# EAGLE schematic soic-8_breakout (EAGLE 7.7.0)
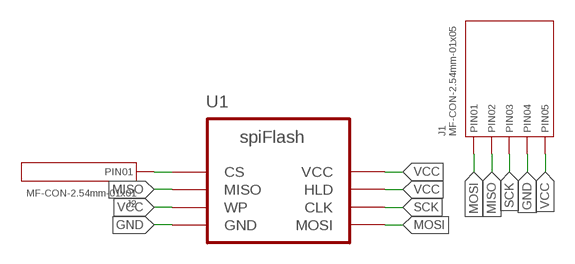
[diagram p0: schematic, sheet 1]

## Parts
J1  MF-CON-2.54mm-01x05  CON_01X05_PTH_2.54MM  [PTH_2.54MM_01X05]
J2  MF-CON-2.54mm-01x01  CON_01X01_PTH_2.54MM  [PTH_2.54MM_01X01]
U1  WINBOND_FLASH_4MBIT-SOIC  [SOIC8]

## Nets
GND: J1.P$4(PIN4) U1.4(GND)
MISO: J1.P$2(PIN2) U1.2(MISO)
MOSI: J1.P$1(PIN1) U1.5(MOSI)
N$1: J2.P$1(PIN1) U1.1(CS)
SCK: J1.P$3(PIN3) U1.6(CLK)
VCC: J1.P$5(PIN5) U1.3(WP) U1.7(HLD) U1.8(VCC)

## Library data of the parts
J1 = My_Connectors:CON_01X05: Library: MF_Connectors Description: Header Connector with 5 Positions and 01 Rows. Use the LABEL Attribute to label the pin on the schematic and PCB. You can remove the attributes on the PCB by using the SMASH function on the part and then deleting the text.; HOUSEPART: YES; MPN: MF-CON-2.54mm-01x05; POPULATE: 1; URL: https://factory.macrofab.com/part/MF-CON-2.54mm-01x05
J2 = My_Connectors:CON_01X01: Library: MF_Connectors Description: Header Connector with 01 Positions and 01 Rows. Use the LABEL Attribute to label the pin on the schematic and PCB. You can remove the attributes on the PCB by using the SMASH function on the part and then deleting the text.; HOUSEPART: YES; MPN: MF-CON-2.54mm-01x01; POPULATE: 1; URL: https://factory.macrofab.com/part/MF-CON-2.54mm-01x01
U1 = My_IC_Digital:WINBOND_FLASH_4MBIT